# EasyEDA Pro project 两盘位(已验证).epro

# Schematic Schematic1
Board Name: Board1; Create Date: 2024-11-02; Page Name: P1; Project Name: 两盘位; Schematic Name: Schematic1; Update Date: 2024-11-16; Company: 嘉立创EDA; Page Size: A4; Version: V1.0
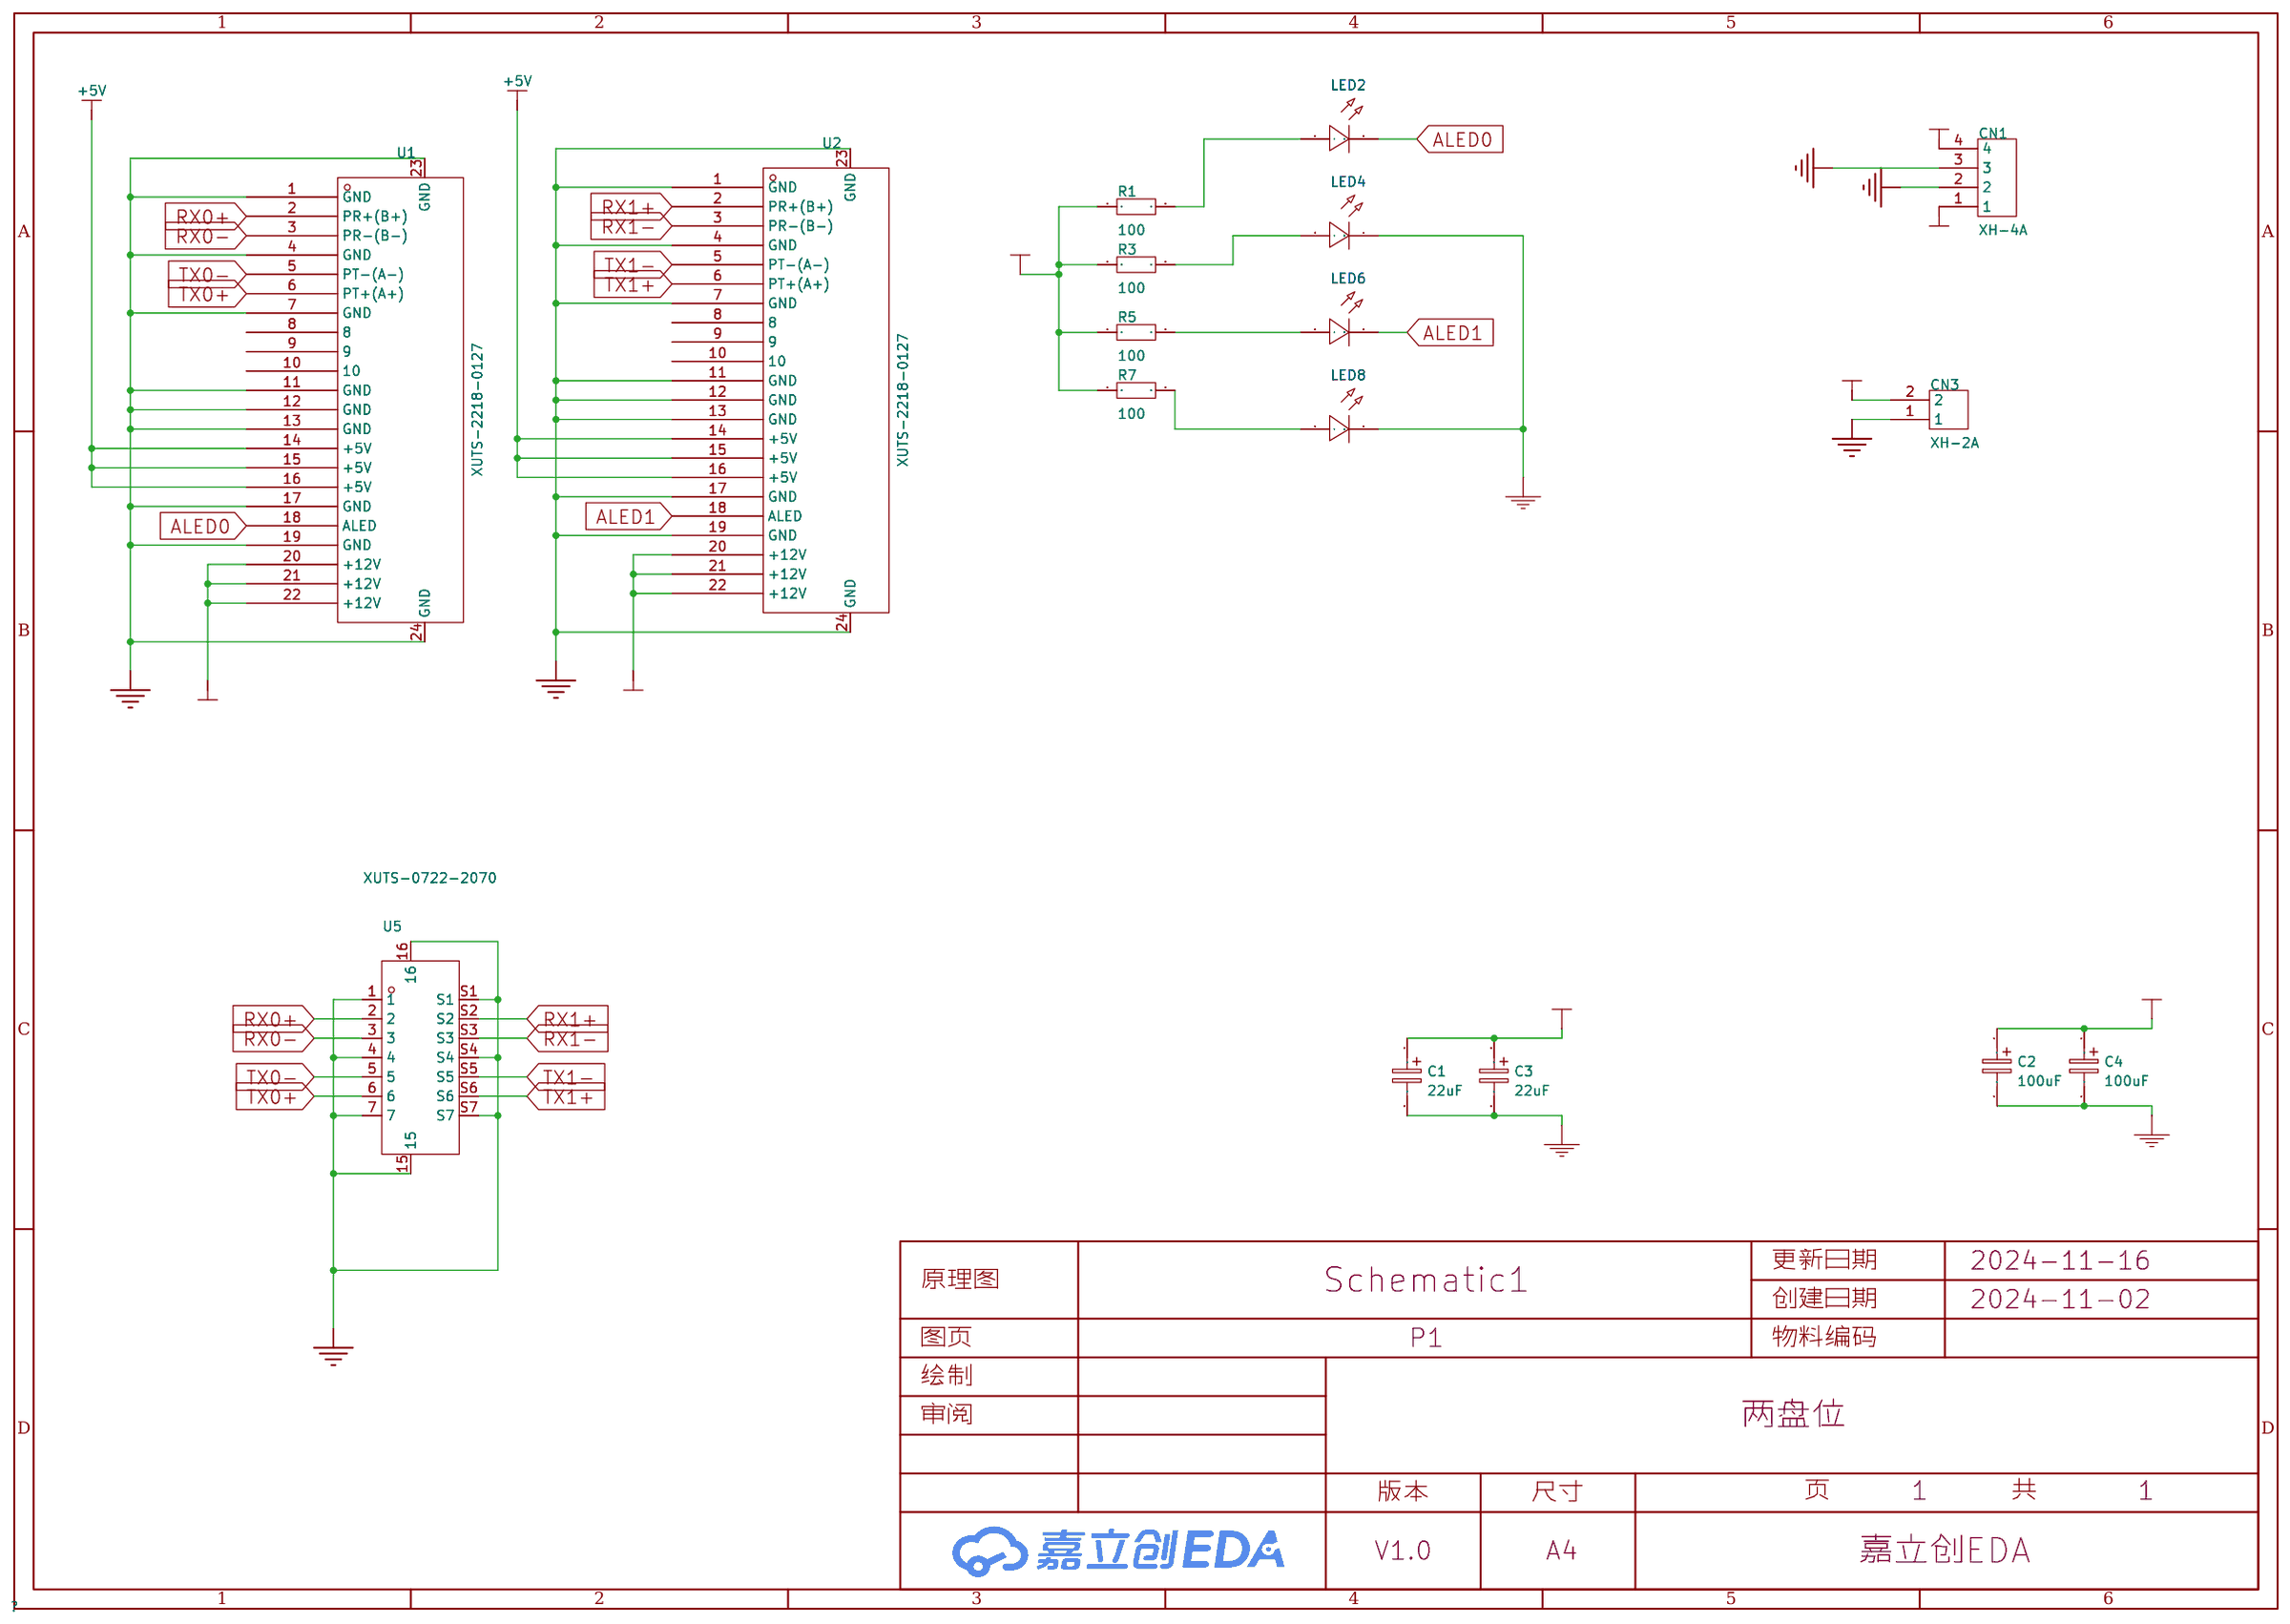
[diagram p0: schematic sheet]

## Parts
C1  22uF  [CAP-SMD_L7.3-W4.3-R-RD]
C2  100uF  [CAP-SMD_L7.3-W4.3-R-RD]
C3  22uF  [CAP-SMD_L7.3-W4.3-R-RD]
C4  100uF  [CAP-SMD_L7.3-W4.3-R-RD]
CN1  XH-4A  [CONN-TH_4P-P2.50_XH-4A]
CN3  XH-2A  [CONN-TH_XH-2A]
LED2  -  [LED_0805]
LED4  -  [LED_0805]
LED6  -  [LED_0805]
LED8  -  [LED_0805]
R1  100  [R0805]
R3  100  [R0805]
R5  100  [R0805]
R7  100  [R0805]
U1  XUTS-2218-0127  [SATA]
U2  XUTS-2218-0127  [SATA]
U5  XUTS-0722-2070  [CONN-TH_XUTS-0722-2070]

## Library data of the parts
C1-C4 = T491D226M020AT: 容值:22uF;精度:±20%;额定电压:20V;等效串联电阻:800mΩ@100kHz;; LCSC Part Name: 22uF ±20% 20V; Supplier Part: C600529; Manufacturer: KEMET(基美); Supplier Footprint: CASE-D-7343; JLCPCB Part Class: 扩展库; Datasheet: https://atta.szlcsc.com/upload/public/pdf/source/20200414/C513336_DE31AF665D184C14FB01CCA8422E339A.pdf; Supplier: LCSC; Tolerance: ±20%; Rated Voltage: 20V; Equivalent Series Resistance(ESR): 800mΩ@100kHz; Operating Temperature: -55℃~+125℃
CN1 = XH-4A_C37815: 插针结构:1x4P;间距:2.5mm;安装方式:-;参考系列:XH;总PIN数:4P;排数:1;每排PIN数:4;行距:-;触头材质:磷青铜;; LCSC Part Name: 系列:XH 间距:2.5mm 1x4P; Supplier Part: C37815; Manufacturer: BOOMELE(博穆精密); Supplier Footprint: 插件,P=2.5mm; JLCPCB Part Class: 扩展库; Datasheet: https://atta.szlcsc.com/upload/public/pdf/source/20181205/C146112_2CB31444E6250AC61E2A41A9A8391D5F.pdf; Supplier: LCSC; Pins Structure: 1x4P; Pitch: 2.5mm; Reference Series: XH; Number of Pins: 4P; Number of Rows: 1; Number of PINs Per Row: 4; Contact Material: 磷青铜
CN3 = XH-2A_C20079: 插针结构:1x2P;间距:2.5mm;安装方式:-;参考系列:XH;总PIN数:2P;排数:1;每排PIN数:2;行距:-;触头材质:-;; LCSC Part Name: 系列:XH 间距:2.5mm 1x2P; Supplier Part: C20079; Manufacturer: BOOMELE(博穆精密); Supplier Footprint: 插件,P=2.5mm; JLCPCB Part Class: 扩展库; Datasheet: https://atta.szlcsc.com/upload/public/pdf/source/20151225/1457707654857.pdf; Supplier: LCSC; Pins Structure: 1x2P; Pitch: 2.5mm; Reference Series: XH; Number of Pins: 2P; Number of Rows: 1; Number of PINs Per Row: 2
LED2 LED6 = LED_0805-B: Supplier Footprint: 0805
LED4 LED8 = LED_0805-G: Supplier Footprint: 0805
R1 R3 R5 R7 = Res_0805: Supplier Footprint: 0805
U1 U2 = XUTS-2218-0127: 连接器类型:SATA;间距:1.27mm;引脚总数:22P;安装方式:立贴;工作温度范围:-40℃~+105℃;; LCSC Part Name: 1.27mm P数:22P; Supplier Part: C19193804; Manufacturer: LX(连欣科技); Supplier Footprint: SMD,P=1.27mm; JLCPCB Part Class: 扩展库; Datasheet: https://atta.szlcsc.com/upload/public/pdf/source/20231117/B34EFEA7383D9ABF34D19E7DB42C8BB5.pdf; Supplier: LCSC; Pitch: 1.27mm; Number of Pins: 22P; Mounting Style: 立贴; Height Above Board: 10.7mm; Contact Material: 铜; Contact Plating: 金; Operating Temperature Range: -40℃~+105℃
U5 = XUTS-0722-2070: 双层SATA 7PIN卧式插板式  SATA连接器; Supplier Part: C18202154; Manufacturer: LX(连欣科技); Supplier Footprint: 弯插,P=1.27mm; JLCPCB Part Class: 扩展库; Datasheet: https://atta.szlcsc.com/upload/public/pdf/source/20230927/921B61857868F30C9D08A08AE02AB091.pdf; Supplier: LCSC

## Nets
+5V: C1.1 C3.1 CN1.1 R1.1 R3.1 R5.1 R7.1 U1.14(+5V) U1.15(+5V) U1.16(+5V) U2.14(+5V) U2.15(+5V) U2.16(+5V)
+12V: C2.1 C4.1 CN1.4 CN3.2 U1.20(+12V) U1.21(+12V) U1.22(+12V) U2.20(+12V) U2.21(+12V) U2.22(+12V)
GND: C1.2 C2.2 C3.2 C4.2 CN1.2 CN1.3 CN3.1 LED4.1(C) LED8.1(C) U1.1(GND) U1.4(GND) U1.7(GND) U1.11(GND) U1.12(GND) U1.13(GND) U1.17(GND) U1.19(GND) U1.23(GND) U1.24(GND) U2.1(GND) U2.4(GND) U2.7(GND) U2.11(GND) U2.12(GND) U2.13(GND) U2.17(GND) U2.19(GND) U2.23(GND) U2.24(GND) U5.1 U5.4 U5.7 U5.15 U5.16 U5.S1 U5.S4 U5.S7
ALED0: LED2.1(C) U1.18(ALED)
ALED1: LED6.1(C) U2.18(ALED)
RX0+: U1.2(PR+(B+)) U5.2
RX0-: U1.3(PR-(B-)) U5.3
RX1+: U2.2(PR+(B+)) U5.S2
RX1-: U2.3(PR-(B-)) U5.S3
TX0+: U1.6(PT+(A+)) U5.6
TX0-: U1.5(PT-(A-)) U5.5
TX1+: U2.6(PT+(A+)) U5.S6
TX1-: U2.5(PT-(A-)) U5.S5
Net-(LED2-2): LED2.2(A) R1.2
Net-(LED4-2): LED4.2(A) R3.2
Net-(LED6-2): LED6.2(A) R5.2
Net-(LED8-2): LED8.2(A) R7.2

Not connected (* = marked no-connect by the designer): U1 8 9 10; U2 8 9 10

# Board PCB1
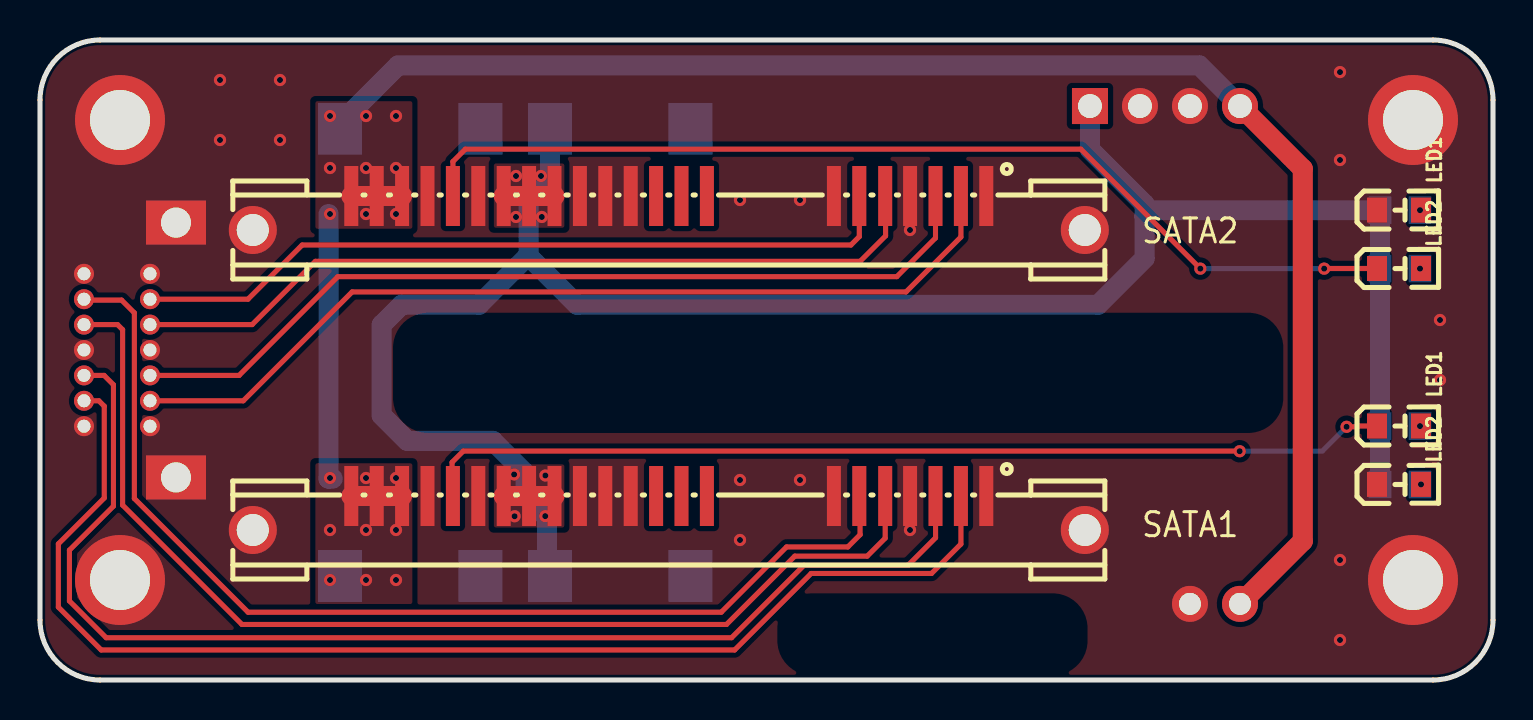
[diagram p1: board, top side]
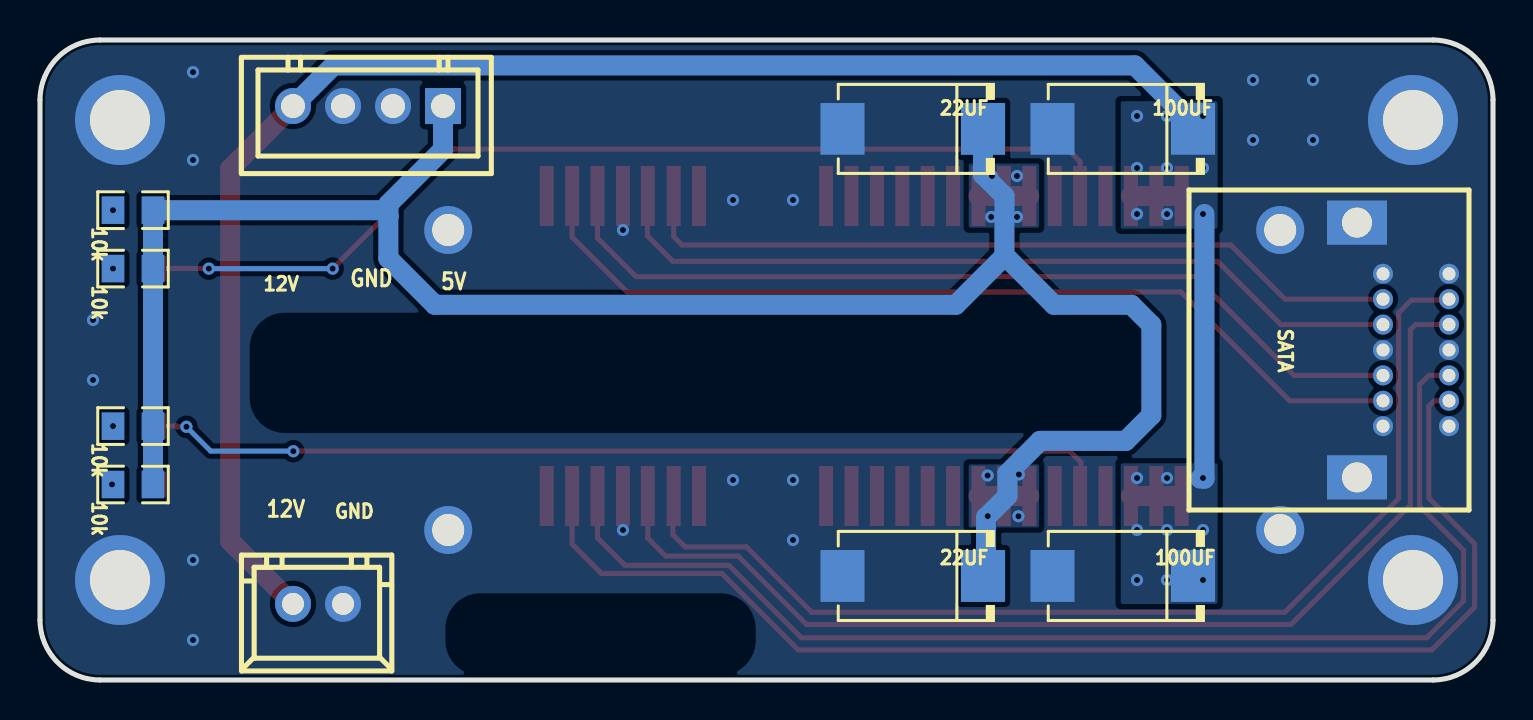
[diagram p2: board, bottom side, seen from below]

Outline 72.65 x 32 mm; copper layers: Top Layer, Bottom Layer. Coordinates in mm from the lower left corner of the outline.
Outline path: 0,29 0,3 arc(0.88,0.88) 3,0 69.65,0 arc(71.77,0.88) 72.65,3 72.65,29 arc(71.77,31.12) 69.65,32 3,32 arc(0.88,31.12) 0,29
Stack: Top Layer 0.035mm / Dielectric1 1.51mm FR4 er 4.5 / Bottom Layer 0.035mm

## Design rules (mm)
template: 自定义配置
spacing copperThickness1oz (default): track to track 0.102, other pairs 0.152 to 0.3
spacing copperThickness2oz: track to track 0.203, other pairs 0.152 to 0.3
track width copperThickness1oz (default): min 0.127, default 0.254, max 2.54
track width copperThickness2oz: min 0.203, default 0.254, max 2.54
differential pair differentialPair (default): width min 0.127, default 0.254, max 2.54; gap min 0.152, default 0.152
via viaSize (default): diameter min 0.5, default 0.61, max 10; hole min 0.3, default 0.305, max 6.3

## Placement (name value [footprint] x y rotation side)
10k  -  [R0805]  68 12.7 0 bottom
10k#2  -  [R0805]  68 9.78 0 bottom
10k#3  -  [R0805]  68 20.57 0 bottom
10k#4  -  [R0805]  68 23.49 0 bottom
12V  XH-4A  [CONN-TH_4P-P2.50_XH-4A]  56.25 28.7 0 bottom
22UF  -  [CAP-SMD_L7.3-W4.3-R-RD]  29.01 5.2 180 bottom
22UF#2  -  [CAP-SMD_L7.3-W4.3-R-RD]  29.01 27.56 180 bottom
100UF  -  [CAP-SMD_L7.3-W4.3-R-RD]  18.51 27.56 180 bottom
100UF#2  -  [CAP-SMD_L7.3-W4.3-R-RD]  18.51 5.2 180 bottom
GND  XH-2A  [CONN-TH_XH-2A]  58.75 3.81 0 bottom
LED1  -  [LED_0805]  68 23.49 0 top
LED1#2  -  [LED_0805]  68 12.7 0 top
LED2  -  [LED_0805]  68 9.78 0 top
LED2#2  -  [LED_0805]  68 20.57 0 top
NOREF  -  [Pad_e62]  68.65 5 0 top
NOREF#2  -  [Pad_e20]  68.65 28 0 top
NOREF#3  -  [Pad_e22]  4 28 0 top
NOREF#4  -  [Pad_e23]  4 5 0 top
SATA  XUTS-0722-2070  [CONN-TH_XUTS-0722-2070]  4.5 16.5 270 bottom
SATA1  XUTS-2218-0127  [SATA]  31.44 8.35 180 top
SATA2  XUTS-2218-0127  [SATA]  31.44 23.35 180 top

## Footprints (pads in the part's own frame, mm; a bottom-side part is the same pattern mirrored in y, then rotated)
CAP-SMD_L7.3-W4.3-R-RD
  rect 2.208x2.592 smd: 1(3.511,0) 2(-3.511,0)
CONN-TH_4P-P2.50_XH-4A
  rect 1.8x1.8 hole 1.199: 1(-3.751,0)
  round 1.8 hole 1.199: 2(-1.25,0) 3(1.25,0) 4(3.751,0)
CONN-TH_XH-2A
  round 1.8 hole 1.1: 1(-1.251,0) 2(1.251,0)
CONN-TH_XUTS-0722-2070
  round 1 hole 0.65: 1(3.81,2.3) 2(2.54,2.3) 3(1.27,2.3) 4(0,2.3) 5(-1.27,2.3) 6(-2.54,2.3) 7(-3.81,2.3) S1(3.81,-1) S2(2.54,-1) S3(1.27,-1) S4(0,-1) S5(-1.27,-1) S6(-2.54,-1) S7(-3.81,-1)
  rect 2.2x3 hole 1.5: 15(6.37,-2.3) 16(-6.37,-2.3)
LED_0805
  rect 1x1.25 smd: 1(-1.15,0.005) 2(1.05,0.005)
Pad_e20
  round 4.5 hole 3: 1(0,0)
Pad_e22
  round 4.5 hole 3: 1(0,0)
Pad_e23
  round 4.5 hole 3: 1(0,0)
Pad_e62
  round 4.5 hole 3: 1(0,0)
R0805
  rect 1.133x1.377 smd: 1(-1,0) 2(1,0)
SATA
  rect 0.7x3 smd: 1(-15.875,-0.85) 2(-14.605,-0.85) 3(-13.335,-0.85) 4(-12.065,-0.85) 5(-10.82,-0.85) 6(-9.525,-0.85) 7(-8.255,-0.85) 8(-1.905,-0.85) 9(-0.635,-0.85) 10(0.635,-0.85) 11(1.905,-0.85) 12(3.175,-0.85) 13(4.445,-0.85) 14(5.715,-0.85) 15(6.985,-0.85) 16(8.255,-0.85) 17(9.525,-0.85) 18(10.795,-0.85) 19(12.065,-0.85) 20(13.335,-0.85) 21(14.605,-0.85) 22(15.875,-0.85)
  round 2.4 hole 1.6: 23(-20.8,0.85) 24(20.8,0.85)

## Nets
+5V: 10k.1 10k#2.1 10k#3.1 10k#4.1 12V.1 22UF.1 22UF#2.1 SATA1.14 SATA1.15 SATA1.16 SATA2.14 SATA2.15 SATA2.16
+12V: 12V.4 100UF.1 100UF#2.1 GND.2 SATA1.20 SATA1.21 SATA1.22 SATA2.20 SATA2.21 SATA2.22
GND: 12V.2 12V.3 22UF.2 22UF#2.2 100UF.2 100UF#2.2 GND.1 LED1.1 LED2.1 NOREF.1 NOREF#2.1 NOREF#3.1 NOREF#4.1 SATA.1 SATA.4 SATA.7 SATA.15 SATA.16 SATA.S1 SATA.S4 SATA.S7 SATA1.1 SATA1.4 SATA1.7 SATA1.11 SATA1.12 SATA1.13 SATA1.17 SATA1.19 SATA1.23 SATA1.24 SATA2.1 SATA2.4 SATA2.7 SATA2.11 SATA2.12 SATA2.13 SATA2.17 SATA2.19 SATA2.23 SATA2.24
ALED0: LED1#2.1 SATA1.18
ALED1: LED2#2.1 SATA2.18
RX0+: SATA.2 SATA1.2
RX0-: SATA.3 SATA1.3
RX1+: SATA.S2 SATA2.2
RX1-: SATA.S3 SATA2.3
TX0+: SATA.6 SATA1.6
TX0-: SATA.5 SATA1.5
TX1+: SATA.S6 SATA2.6
TX1-: SATA.S5 SATA2.5
$1N895: 10k#2.2 LED2.2
$1N896: 10k#3.2 LED2#2.2
$1N899: 10k#4.2 LED1.2
$1N902: 10k.2 LED1#2.2

Pads without a net: SATA1 8 9 10; SATA2 8 9 10

## Via types
v1: diameter 0.61, hole 0.305, Top Layer to Bottom Layer, 51 vias

## Routing (per net, layer and track width the routed paths; a pad name or vN(x,y) marks a point on that pad's centre or on a via; arc(x,y) is an arc through that point)
+5V: length 106.3
  Top Layer w1: SATA2.16 SATA2.14 ; SATA1.16 SATA1.14
  Bottom Layer w1: 22UF#2.1 25.5,25.27 24.43,24.2 24.43,21.19 ; 55.23,23.19 55.23,23.18 55.23,21.09 52.91,18.76 26.86,18.76 24.43,21.19 ; 55.23,23.19 55.53,23.49 10k#4.1 10k#3.1 10k.1 10k#2.1 ; 55.23,23.19 55.23,23.8 52.5,26.52 12V.1 ; 24.43,21.19 24.38,21.19 21.95,18.76 18.09,18.76 17.08,17.76 17.08,13.23 18.36,11.96 22.65,11.96 24.28,10.32 24.28,9.2 25.35,8.13 25.35,5.36 22UF.1
  vias: v1(23.71,10.28) v1(23.73,8.19) v1(23.8,25.2) v1(23.8,23.15) v1(25.05,25.2) v1(25.09,23.15) v1(25.27,10.22) v1(25.26,8.19)
+12V: length 93.3
  Top Layer w1: SATA2.22 SATA2.21 SATA2.20 ; SATA1.20 SATA1.21 SATA1.22 ; GND.2 63.14,6.94 63.14,25.56 12V.4
  Bottom Layer w1: 12V.4 57.97,30.73 17.91,30.73 15,27.82 100UF.1 ; 14.43,23.3 14.43,10.07 14.43,10.07 14.64,10.07
  vias: v1(14.5,28.2) v1(14.5,25.6) v1(14.5,23.3) v1(14.5,10.1) v1(14.5,7.5) v1(14.5,5) v1(16.3,28.2) v1(16.3,25.6) v1(16.3,23.3) v1(16.3,10.1) v1(16.3,7.5) v1(16.3,5) v1(17.8,28.2) v1(17.8,25.6) v1(17.8,23.3) v1(17.8,10.1) v1(17.8,7.5) v1(17.8,5)
GND:
  vias: v1(9,30) v1(9,27) v1(12,30) v1(12,27) v1(35,24) v1(35,10) v1(35,7) v1(38,24) v1(38,10) v1(43.5,22.5) v1(43.5,7.5) v1(65,30.39) v1(65,26) v1(65,6) v1(65,2) v1(70,18) v1(70,15)
ALED0: length 48.7
  Top Layer w0.254: v1(59.98,11.44) 59.98,11.45 21.17,11.45 20.6,10.89 20.6,9.24 SATA1.18 ; LED1#2.1 65.84,12.7 65.8,12.66 v1(65.33,12.66)
  Bottom Layer w0.254: v1(59.98,11.44) 59.99,11.45 64.12,11.45 v1(65.33,12.66)
ALED1: length 50.7
  Top Layer w0.254: v1(64.21,20.57) 64.22,20.58 66.85,20.58 ; v1(58.02,20.57) 52.04,26.54 21.27,26.54 20.65,25.92 SATA2.18
  Bottom Layer w0.254: v1(64.21,20.57) v1(58.02,20.57)
RX0+: length 62.7
  Top Layer w0.254: SATA1.2 46.04,6.8 44.57,5.33 38.56,5.33 34.73,1.5 3.06,1.5 0.92,3.64 0.92,6.81 3.21,9.1 3.21,13.69 2.94,13.96 SATA.2
RX0-: length 61.6
  Top Layer w0.254: SATA1.3 44.78,9.2 44.78,7.11 43.4,5.73 38.2,5.73 34.58,2.11 3.31,2.11 1.47,3.95 1.47,6.49 3.67,8.69 3.67,14.76 3.2,15.23 SATA.3
RX1+: length 46
  Top Layer w0.254: SATA2.2 46.04,22.15 43.3,19.4 15.61,19.4 10.16,13.96 SATA.S2
RX1-: length 44.2
  Top Layer w0.254: SATA2.3 44.78,22.1 42.84,20.17 14.89,20.17 9.95,15.23 SATA.S3
TX0+: length 54.3
  Top Layer w0.254: SATA.6 2.25,19 4.08,19 4.72,18.36 4.72,9.08 10.4,3.39 34.06,3.39 37.33,6.65 40.39,6.65 41,7.26 41,9.16 SATA1.6
TX0-: length 55.3
  Top Layer w0.254: SATA1.5 42.26,7.09 41.36,6.19 37.74,6.19 34.32,2.78 10.1,2.78 4.13,8.74 4.13,17.52 3.88,17.77 SATA.5
TX1+: length 38.8
  Top Layer w0.254: SATA.S6 10.4,19.04 13.11,21.75 40.55,21.75 40.97,22.17 SATA2.6
TX1-: length 40.6
  Top Layer w0.254: SATA2.5 42.28,24.18 42.28,22.21 41,20.93 13.77,20.93 10.61,17.77 5.5,17.77
$1N895:
  vias: v1(69.05,9.78)
$1N896:
  vias: v1(69,20.57)
$1N899:
  vias: v1(69,23.49)
$1N902:
  vias: v1(69,12.7)

## Copper pours and planes (outline as drawn; the poured copper is in the pictures)
+5V on Top Layer: 22.7,10.78 26.21,10.78 26.21,7.62 22.7,7.62
+5V on Top Layer: 22.7,25.83 26.21,25.83 26.21,22.62 22.7,22.62
+5V on Bottom Layer: 22.7,10.78 26.21,10.78 26.21,7.62 22.7,7.62
+5V on Bottom Layer: 22.7,25.83 26.21,25.83 26.21,22.62 22.7,22.62
+12V on Top Layer: 13.77,10.83 18.62,10.83 18.62,3.8 13.77,3.8
+12V on Top Layer: 13.77,28.94 18.62,28.94 18.62,22.56 13.77,22.56
+12V on Bottom Layer: 13.77,10.83 18.62,10.83 18.62,3.8 13.77,3.8
+12V on Bottom Layer: 13.77,28.94 18.62,28.94 18.62,22.56 13.77,22.56
GND on Top Layer: 0,32 72.68,32 72.68,-0.03 0,-0.03
GND on Bottom Layer: 0,32 72.68,32 72.68,-0.03 0,-0.03

## Text on the board
Bottom Silkscreen Layer: 12V | 5V | GND
